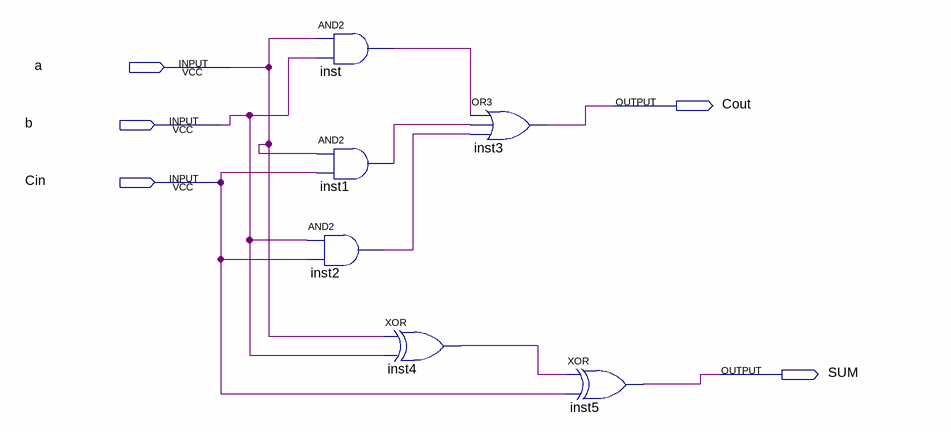
[diagram p0: schematic sheet]
// Quartus schematic FA.bdf as structural Verilog: 6 symbols, 5 pins
module FA (
  input  a,
  input  b,
  input  Cin,
  output Cout,
  output SUM
);

  wire inst1_out, inst2_out, inst4_out, inst_out;

  and inst2 (inst2_out, b, Cin);
  and inst (inst_out, a, b);
  and inst1 (inst1_out, a, Cin);
  xor inst4 (inst4_out, a, b);
  or inst3 (Cout, inst_out, inst1_out, inst2_out);
  xor inst5 (SUM, inst4_out, Cin);
endmodule
